# Altium schematic sheet schematic.SchDoc
size A4; SheetNumber: 1; SheetTotal: 1
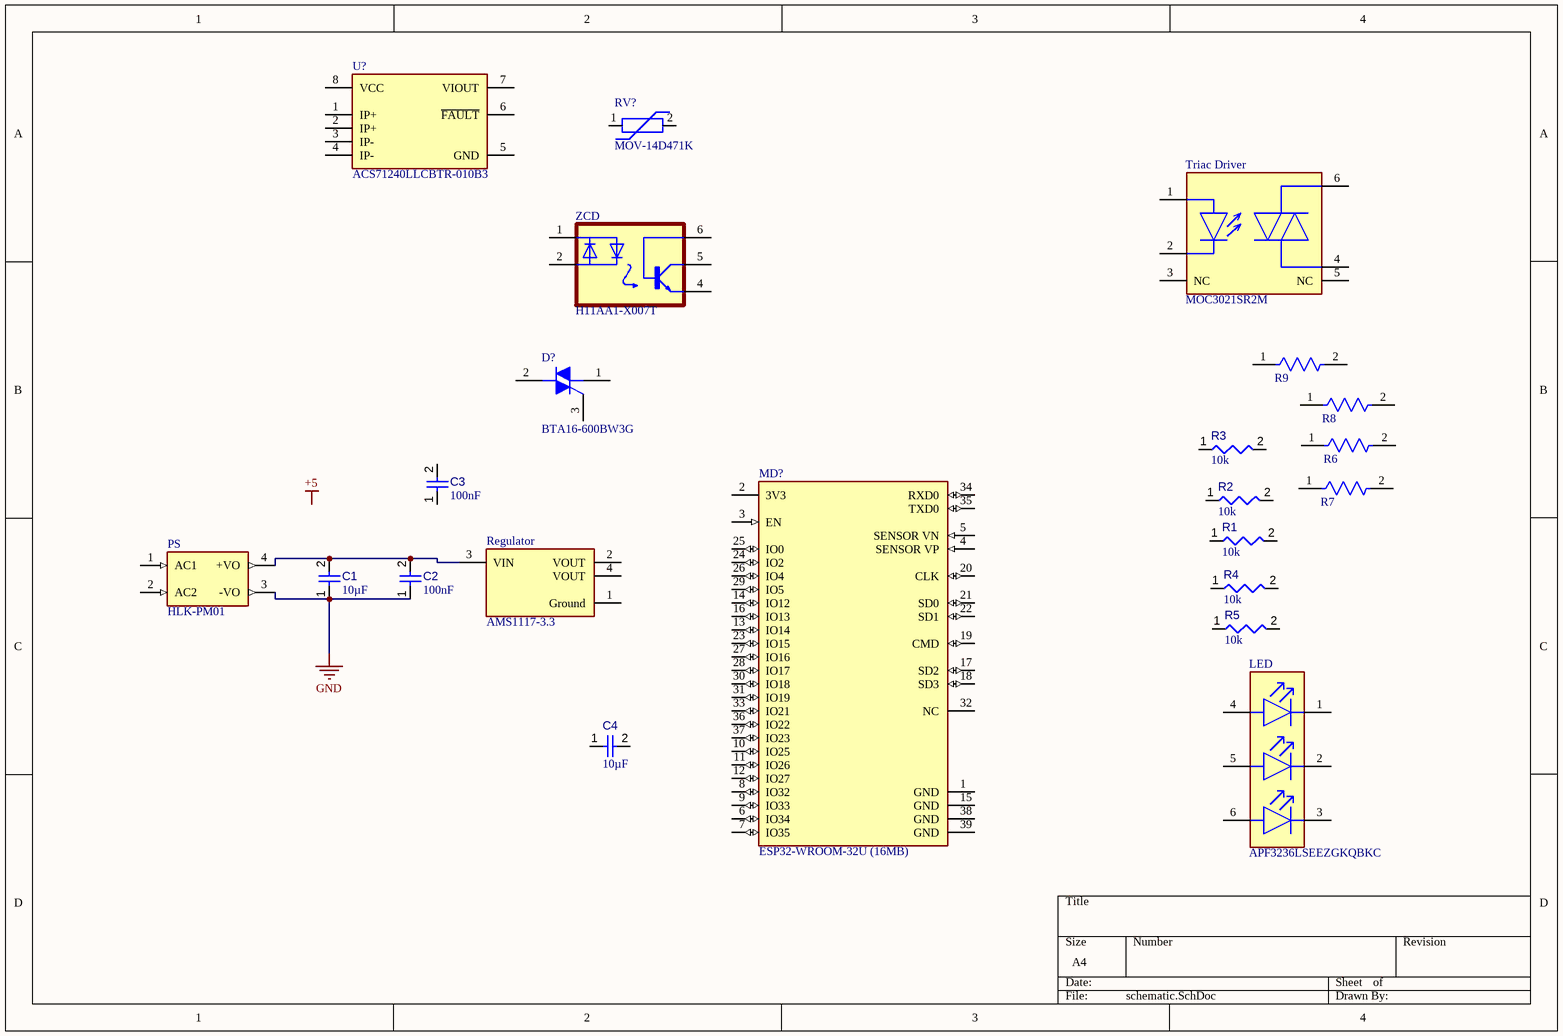
[diagram p0: schematic.SchDoc]

## Parts
C1  value 10µF  [CAPC0805(2012)145_L]  (hidden comment: Capacitor 10µF +/-20% 25V 0805)
C2  value 100nF  [CAPC2013X95X50LL10T25]  (hidden comment: Capacitor 100 nF +/-10% 50 V 0805)
C3  value 100nF  [CAPC2013X95X50LL10T25]  (hidden comment: Capacitor 100 nF +/-10% 50 V 0805)
C4  value 10µF  [CAPC0805(2012)145_L]  (hidden comment: Capacitor 10µF +/-20% 25V 0805)
D?  BTA16-600BW3G  [ONSC-TO-220-3-221A-07]
LED  APF3236LSEEZGKQBKC  [FP-APF3236LSEEZGKQBKC-MFG]
MD?  ESP32-WROOM-32U (16MB)  [FP-ESP32-WROOM-32U_16MB-MFG]
PS  HLK-PM01  [CONV_HLK-PM01]
R1  value 10k  [RESC2013X50X35ML15T15]  (hidden comment: Resistor 10k +/-1% 0805 125 mW)
R2  value 10k  [RESC2013X50X35ML15T15]  (hidden comment: Resistor 10k +/-1% 0805 125 mW)
R3  value 10k  [RESC2013X50X35ML15T15]  (hidden comment: Resistor 10k +/-1% 0805 125 mW)
R4  value 10k  [RESC2013X50X35ML15T15]  (hidden comment: Resistor 10k +/-1% 0805 125 mW)
R5  value 10k  [RESC2013X50X35ML15T15]  (hidden comment: Resistor 10k +/-1% 0805 125 mW)
R6  AC0805JR-07220RL  [FP-AC0805-IPC_A]  (value not drawn)
R7  AC0805JR-07220RL  [FP-AC0805-IPC_A]  (value not drawn)
R8  AC0805JR-07220RL  [FP-AC0805-IPC_A]  (value not drawn)
R9  AC0805JR-07330RL  [FP-AC0805-IPC_A]  (value not drawn)
Regulator  AMS1117-3.3  [FP-AMS1117-IPC_B]
RV?  MOV-14D471K  [MOV14D471K]
Triac_Driver  MOC3021SR2M  [FP-646BY-MFG]
U?  ACS71240LLCBTR-010B3  [FP-LCB-8-IPC_B]
ZCD  H11AA1-X007T  [SOIC254P1030X460-6N]

## Nets
GND: C1.1 C2.1 PS.3(-VO)
NetC1_2: C1.2 C2.2 PS.4(+VO) Regulator.3(VIN)

Not connected (* = marked no-connect by the designer): C3 1 2; C4 1 2; D? 1(MT1) 2(MT2) 3(G); LED 1(RED_C) 2(GREEN_C) 3(BLUE_C) 4(RED_A) 5(GREEN_A) 6(BLUE_A); MD? 1(GND) 2(3V3) 3(EN) 4(SENSOR_VP) 5(SENSOR_VN) 6(IO34) 7(IO35) 8(IO32) 9(IO33) 10(IO25) 11(IO26) 12(IO27) 13(IO14) 14(IO12) 15(GND) 16(IO13) 17(SD2) 18(SD3) 19(CMD) 20(CLK) 21(SD0) 22(SD1) 23(IO15) 24(IO2) 25(IO0) 26(IO4) 27(IO16) 28(IO17) 29(IO5) 30(IO18) 31(IO19) 32(NC) 33(IO21) 34(RXD0) 35(TXD0) 36(IO22) 37(IO23) 38(GND) 39(GND); PS 1(AC1) 2(AC2); R1 1 2; R2 1 2; R3 1 2; R4 1 2; R5 1 2; R6 1 2; R7 1 2; R8 1 2; R9 1 2; Regulator 1(Ground) 2(VOUT) 4(VOUT); RV? 1 2; Triac_Driver 1(A) 2(C) 3(NC) 4(1_MAIN_TERM.) 5(NC) 6(2_MAIN_TERM.); U? 1(IP+) 2(IP+) 3(IP-) 4(IP-) 5(GND) 6(~{FAULT}) 7(VIOUT) 8(VCC); ZCD 1(A/C) 2(C/A) 4(E) 5(C) 6(B)

## Notes on the sheet
- Labels drawn without touching a wire or pin: +5

## Library data of the parts
C1 C4 = CMP-001-00079-4: Chip Capacitor, 10µF +/-20%, 25V, 0805, Thickness 1.45 mm; Tolerance: 10%; Max Operating Temperature: 85°C; Case/Package: 0805; Voltage Rating: 25V; Min Operating Temperature: -55°C; Mounting Technology: SMT; Pins: 2
C2 C3 = CMP-001-00018-6: Chip Capacitor, 100 nF, +/- 10%, 50 V, 0805 (2012 Metric); Capacitor Type: Ceramic; Voltage Rating: 50V; Pins: 2; Max Operating Temperature: 125°C; Min Operating Temperature: -55°C; Mounting Technology: SM; Case/Package: 0805; RoHS Compliant: True; Tolerance: 10%
D? = CMP-013-00034-1: Triac, 3 Quadrant Internally Isolated, 50 mA IGT, 16 A IT(RMS) 600 V
LED = CMP-007-00036-1: LED Tri-Color Blue/Green/Hyper Red 460nm/515nm/630nm 6-Pin SMD T/R
MD? = CMP-020-00024-1: Wifi Module 128MBITS Spi Flash
PS = CMP-003-000000-1: The HLK-PM01 is a small size low cost AC to DC converter which can take in 110V/220V AC at 50/60 Hz and give 5V 3W output. The module is can be used in designs which run on 5V and needs to be powered form the AC mains.; MF: Hi-link; Source: HLK-PM01.SchLib; MP: hlk-pm01; Check_prices: https://www.snapeda.com/parts/hlk-pm01/Hi-link/view-part/?ref=eda; Value: *; SnapEDA_Link: https://www.snapeda.com/parts/hlk-pm01/Hi-link/view-part/?ref=snap; Pin Count: 4; Package: None; Design Item ID: HLK-PM01; Component Type: Standard
R1-R5 = CMP-009-00018-5: Chip Resistor, 10 KOhm, +/- 1%, 125 mW, -55 to 155 degC, 0805 (2012 Metric); Power: 125mW; Voltage Rating: 150V; Tolerance: 1%; Pins: 2; Min Operating Temperature: -55°C; Case/Package: 0805; Max Operating Temperature: 155°C; RoHS Compliant: True; Mounting Technology: SM
R6-R8 = CMP-009-00177-1: Res Thick Film 0805 220 Ohm 5% 0.125W(1/8W) ±100ppm/C Pad SMD T/R Automotive AEC-Q200
R9 = CMP-009-00178-1: Res Thick Film 0805 330 Ohm 5% 0.125W(1/8W) ±100ppm/C Pad SMD T/R Automotive AEC-Q200
Regulator = CMP-019-00049-1: Gull Wing EAR99 Fixed Positive Single Output Ldo Regulator Dual Voltage Regulator Linear 125C 1.2W 1A 1.8MM
RV? = CMP-007-000000-1: 470 V 4.5 kA Varistor 1 Circuit Through Hole Disc 14mm; MF: Bourns; MP: MOV-14D471K; Package: Disc-14 Bourns; Purchase-URL: https://pricing.snapeda.com/search/part/MOV-14D471K/?ref=eda; SnapEDA_Link: https://www.snapeda.com/parts/MOV-14D471K/Bourns/view-part/?ref=snap; Pin Count: 2; Component Type: Standard; Design Item ID: MOV-14D471K; Source: MOV-14D471K.SchLib; Check_prices: https://www.snapeda.com/parts/MOV-14D471K/Bourns/view-part/?ref=eda; Availability: In Stock; Value: *; Price: None
Triac_Driver = CMP-00026-00002-1: Optocoupler, Triac Output, Surface Mount DIP, 6 Pins, 5.3 kV, Non Zero Crossing, 400 V
U? = CMP-001-0000-1: Current Sensor Ic With Common Mode Rejection And Overcurrent Fault
ZCD = CMP-005-000000-1: H11AA1 Series Single Channel 30V 5300 Vrms SMT Phototransistor Optocoupler DIP-6; MF: Vishay Semiconductor; Pin Count: 5; Design Item ID: H11AA1-X007T; SnapEDA_Link: https://www.snapeda.com/parts/H11AA1-X007T/Vishay/view-part/?ref=snap; Value: *; Source: H11AA1-X007T.SchLib; Check_prices: https://www.snapeda.com/parts/H11AA1-X007T/Vishay/view-part/?ref=eda; Component Type: Standard; Package: SMD-6 Vishay; MP: H11AA1-X007T